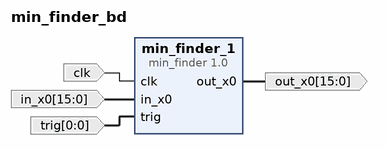
[diagram p0: block diagram of the top level]
# Vivado block design min_finder_bd, xc7k160tfbg484-2, Vivado 2021.2
create_bd_design min_finder_bd

create_bd_port -dir I -type clk clk
create_bd_port -dir I -from 15 -to 0 -type data in_x0
create_bd_port -dir O -from 15 -to 0 -type data out_x0
create_bd_port -dir I -from 0 -to 0 -type data trig

create_bd_cell -type ip -vlnv User_Company:SysGen:min_finder:1.0 min_finder_1

# ---- connections ----

connect_bd_net [get_bd_ports clk] [get_bd_pins min_finder_1/clk]
connect_bd_net -net in_x0_1 [get_bd_ports in_x0] [get_bd_pins min_finder_1/in_x0]
connect_bd_net [get_bd_pins min_finder_1/out_x0] [get_bd_ports out_x0]
connect_bd_net [get_bd_ports trig] [get_bd_pins min_finder_1/trig]

validate_bd_design
save_bd_design
